# EAGLE design pegpixel-pcb (EAGLE 9.2.2)
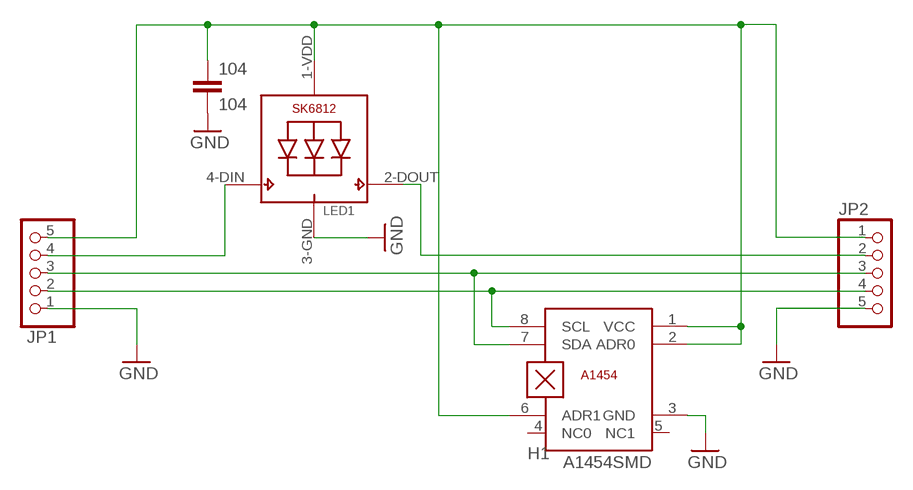
[diagram p0: schematic, sheet 1]

## Parts
104  104  C-EUC0805  [C0805]
H1  A1454SMD  [TSSOP8]
JP1  PINHD-1X5/90  [1X05/90]
JP2  PINHD-1X5/90  [1X05/90]
LED1  SK6812_5050  [LED5050]

## Nets
DIN: JP1.4 LED1.4-DIN(DI)
DOUT: JP2.2 LED1.2-DOUT(DO)
GND: 104.2 H1.3(GND) JP1.1 JP2.5 LED1.3-GND(GND)
SCL: H1.8(SCL) JP1.2 JP2.4
SDA: H1.7(SDA) JP1.3 JP2.3
VCC: 104.1 H1.1(VCC) H1.2(ADR0) H1.6(ADR1) JP1.5 JP2.1 LED1.1-VDD(VDD)
Unconnected: H1.4(NC0) H1.5(NC1)

## Library data of the parts
104 = rcl:C-EU: CAPACITOR, European symbol; SPICEPREFIX: C
H1 = a1454:A1454: Allegro A1454 Hall Effect Sensor with I2C Interface
JP1 JP2 = pinhead:PINHD-1X5: PIN HEADER
LED1 = SK6812:SK6812

## Net classes
0 default: width 0.305 mm, drill 0.508 mm, clearance 0.254 mm

## Board
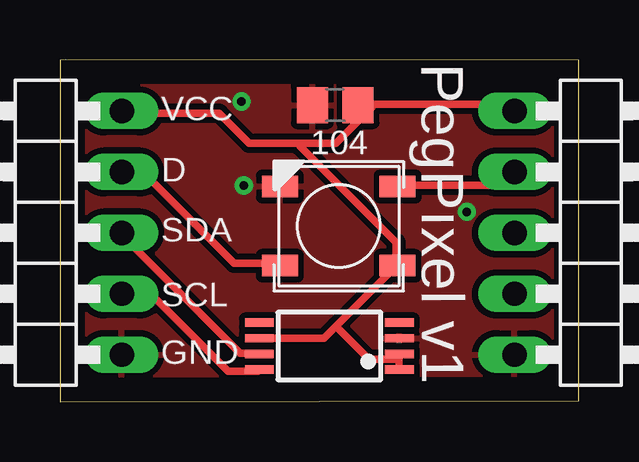
[diagram p1: board, top side]
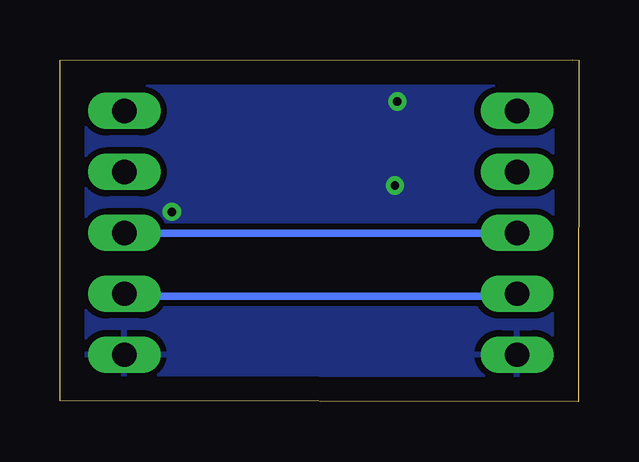
[diagram p2: board, bottom side, seen from below]

Size 21.64 x 14.23 mm. Coordinates in mm from the lower left corner, seen from the top.
Outline: 0,14.22 0.02,0.29 0.01,0 21.64,0.03 21.64,14.23 0.25,14.23 0,14.22
Copper layers (1*16): Top 0.035mm / dielectric 1.5mm / Bottom 0.035mm
Design rules "default": minimum track width 6mil, minimum drill 0.35mm, track to track 6mil, track to pad 6mil, pad to pad 6mil, via to via 6mil, smd to smd 6mil, copper to edge 40mil, drill to drill 6mil, minimum pad ring 10mil, minimum via ring 8mil, stop-mask expansion 4mil, vias tented up to drill 0mil, thermal gap 10mil

### Footprints (pad centres in the part's own frame; a part is rotated, then mirrored left to right if it is on the bottom)
C0805 = smd 1.3 x 1.5: 1 -0.95,0; 2 0.95,0
TSSOP8 = smd 0.35 x 1.2: 1 -0.975,-2.925; 2 -0.325,-2.925; 3 0.325,-2.925; 4 0.975,-2.925; 5 0.975,2.925; 6 0.325,2.925; 7 -0.325,2.925; 8 -0.975,2.925
1X05/90 = drill 1.016 long: 1 -5.08,-3.81; 2 -2.54,-3.81; 3 0,-3.81; 4 2.54,-3.81; 5 5.08,-3.81
LED5050 = smd 1.5 x 0.9: 1-VDD 2.45,-1.65; 2-DOUT 2.45,1.65; 3-GND -2.45,1.65; 4-DIN -2.45,-1.65

### Placement (x,y rotation side)
104  11.48,12.35 180 top
H1  11.24,2.31 90 top
JP1  -1.23,7.03 90 top
JP2  22.77,7.03 270 top
LED1  11.63,7.31 0 top

### Tracks (layer width: path | path; a pad name or v marks a point on that pad's centre or on a via)
DIN
  Top 0.305: LED1.4-DIN 9.14,5.76 7.27,5.76 3.52,9.51 2.64,9.51 JP1.4
DOUT
  Top 0.305: LED1.2-DOUT 14.14,9.01 18.39,9.01 18.89,9.51 JP2.2
GND  (via drill 0.35)
  other vias: 7.57,12.51 16.97,7.91 7.67,9.01
  pour Top: -3.23,15.53 -3.23,-2.97 22.77,-2.97 22.77,15.53
  pour Bottom: -2.23,15.03 -2.23,-1.47 22.77,-1.47 22.77,15.03
SCL
  Top 0.305: H1.8 8.27,1.26 7.02,1.26 3.89,4.38 2.64,4.38 JP1.2
  Bottom 0.305: JP2.4 18.89,4.38 2.64,4.38 JP1.2
SDA
  Top 0.305: H1.7 8.27,2.01 7.52,2.01 2.52,7.01 JP1.3
  Bottom 0.305: JP2.3 18.89,7.01 2.64,7.01 JP1.3
VCC
  Top 0.305: 14.14,1.76 14.14,1.88 H1.2 | 14.14,1.76 14.14,1.38 H1.1 | 11.52,3.13 14.02,5.63 LED1.1-VDD 14.02,5.76 14.02,6.63 10.02,10.63 10.02,10.76 | 11.52,3.13 11.02,2.63 8.39,2.63 H1.6 | 14.14,1.76 12.89,1.76 11.52,3.13 | JP2.1 18.89,12.13 18.64,12.38 12.52,12.38 104.1 13.02,12.26 11.52,10.76 10.02,10.76 | 10.02,10.76 7.89,10.76 6.64,12.01 2.64,12.01 JP1.5

### Text on the board
tNames: VCC | D | SDA | SCL | GND | PegPıxel v1